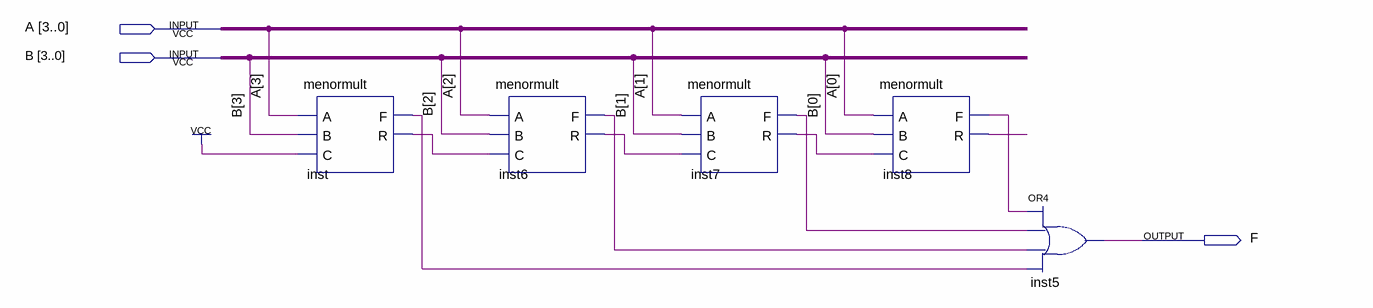
[diagram p0: schematic sheet]
// Quartus schematic menor4bit.bdf as structural Verilog: 5 symbols, 3 pins
module menor4bit (
  input  [3:0] A,
  input  [3:0] B,
  output F
);

  wire inst6_f, inst6_r, inst7_f, inst7_r, inst8_f, inst8_r, inst_f, inst_r;

  menormult inst (.A(A[3]), .B(B[3]), .C(1'b1), .F(inst_f), .R(inst_r));
  menormult inst6 (.A(A[2]), .B(B[2]), .C(inst_r), .F(inst6_f), .R(inst6_r));
  menormult inst7 (.A(A[1]), .B(B[1]), .C(inst6_r), .F(inst7_f), .R(inst7_r));
  menormult inst8 (.A(A[0]), .B(B[0]), .C(inst7_r), .F(inst8_f), .R(inst8_r));
  or inst5 (F, inst8_f, inst7_f, inst6_f, inst_f);
endmodule
